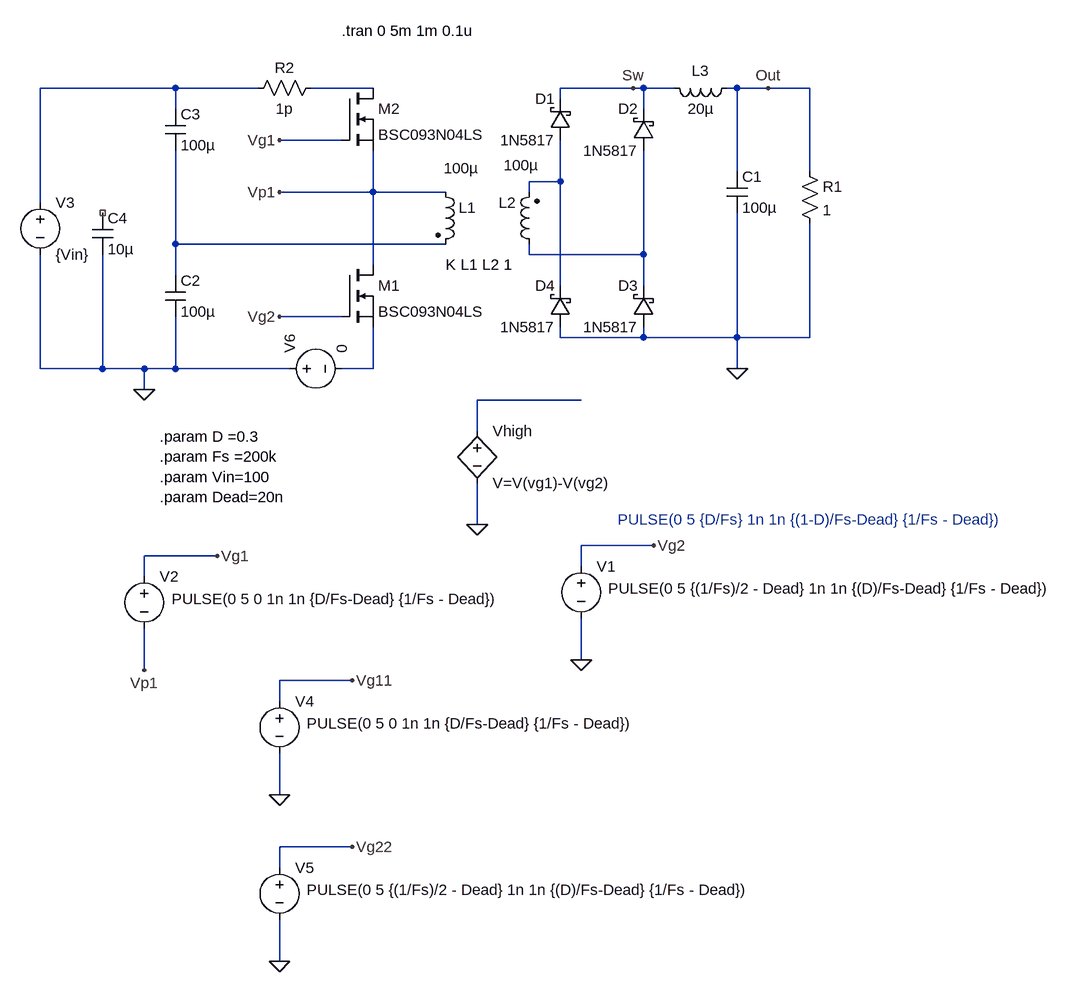
[diagram p0: schematic halflBridgeDCDC.asc]
halflBridgeDCDC.asc, the LTspice schematic file:
Version 4
SHEET 1 2100 1332
WIRE 656 -32 448 -32
WIRE 784 -32 656 -32
WIRE 960 -32 864 -32
WIRE 1360 -32 1248 -32
WIRE 1376 -32 1360 -32
WIRE 1424 -32 1376 -32
WIRE 1520 -32 1504 -32
WIRE 1568 -32 1520 -32
WIRE 1632 -32 1568 -32
WIRE 1248 -16 1248 -32
WIRE 656 0 656 -32
WIRE 1376 0 1376 -32
WIRE 912 48 816 48
WIRE 1520 96 1520 -32
WIRE 1632 96 1632 -32
WIRE 1248 112 1248 48
WIRE 1248 112 1200 112
WIRE 960 128 960 64
WIRE 960 128 816 128
WIRE 1072 128 960 128
WIRE 1200 128 1200 112
WIRE 448 144 448 -32
WIRE 656 208 656 64
WIRE 1072 208 656 208
WIRE 1200 224 1200 208
WIRE 1376 224 1376 64
WIRE 1376 224 1200 224
WIRE 960 240 960 128
WIRE 656 256 656 208
WIRE 1248 272 1248 112
WIRE 1376 272 1376 224
WIRE 912 320 816 320
WIRE 1248 352 1248 336
WIRE 1376 352 1376 336
WIRE 1376 352 1248 352
WIRE 1520 352 1520 160
WIRE 1520 352 1376 352
WIRE 1632 352 1632 176
WIRE 1632 352 1520 352
WIRE 448 400 448 224
WIRE 544 400 544 224
WIRE 544 400 448 400
WIRE 608 400 544 400
WIRE 656 400 656 320
WIRE 656 400 608 400
WIRE 832 400 656 400
WIRE 960 400 960 336
WIRE 960 400 912 400
WIRE 1520 400 1520 352
WIRE 608 432 608 400
WIRE 1280 448 1120 448
WIRE 1120 496 1120 448
WIRE 1120 640 1120 576
WIRE 1392 672 1280 672
WIRE 720 688 608 688
WIRE 1280 704 1280 672
WIRE 608 720 608 688
WIRE 1280 848 1280 784
WIRE 608 864 608 800
WIRE 928 880 816 880
WIRE 816 912 816 880
WIRE 816 1056 816 992
WIRE 928 1136 816 1136
WIRE 816 1168 816 1136
WIRE 816 1312 816 1248
FLAG 720 688 Vg1
FLAG 608 432 0
FLAG 1568 -32 Out
FLAG 1360 -32 Sw
FLAG 1520 400 0
FLAG 816 128 Vp1
FLAG 608 864 Vp1
FLAG 816 48 Vg1
FLAG 1392 672 Vg2
FLAG 1280 848 0
FLAG 816 320 Vg2
FLAG 1120 640 0
FLAG 928 880 Vg11
FLAG 816 1056 0
FLAG 928 1136 Vg22
FLAG 816 1312 0
SYMBOL voltage 608 704 R0
WINDOW 3 42 50 Left 2
WINDOW 123 0 0 Left 0
WINDOW 39 0 0 Left 0
SYMATTR Value PULSE(0 5 0 1n 1n {D/Fs-Dead} {1/Fs - Dead})
SYMATTR InstName V2
SYMBOL nmos 912 -32 R0
SYMATTR InstName M2
SYMATTR Value BSC093N04LS
SYMBOL ind2 1056 112 R0
WINDOW 3 13 -21 Left 2
SYMATTR Value 100µ
SYMATTR InstName L1
SYMATTR Type ind
SYMBOL ind2 1216 224 R180
WINDOW 0 36 80 Left 2
WINDOW 3 1 137 Left 2
SYMATTR InstName L2
SYMATTR Value 100µ
SYMATTR Type ind
SYMBOL schottky 1264 48 R180
WINDOW 0 24 64 Left 2
WINDOW 3 24 0 Left 2
SYMATTR InstName D1
SYMATTR Value 1N5817
SYMATTR Description Diode
SYMATTR Type diode
SYMBOL cap 1504 96 R0
SYMATTR InstName C1
SYMATTR Value 100µ
SYMATTR SpiceLine Rser=1m
SYMBOL ind 1520 -48 R90
WINDOW 0 5 56 VBottom 2
WINDOW 3 32 56 VTop 2
SYMATTR InstName L3
SYMATTR Value 20µ
SYMATTR SpiceLine Rser=10u
SYMBOL res 1616 80 R0
SYMATTR InstName R1
SYMATTR Value 1
SYMBOL voltage 448 128 R0
WINDOW 123 0 0 Left 0
WINDOW 39 0 0 Left 0
SYMATTR InstName V3
SYMATTR Value {Vin}
SYMBOL schottky 1392 64 R180
WINDOW 0 24 64 Left 2
WINDOW 3 24 0 Left 2
SYMATTR InstName D2
SYMATTR Value 1N5817
SYMATTR Description Diode
SYMATTR Type diode
SYMBOL schottky 1392 336 R180
WINDOW 0 24 64 Left 2
WINDOW 3 24 0 Left 2
SYMATTR InstName D3
SYMATTR Value 1N5817
SYMATTR Description Diode
SYMATTR Type diode
SYMBOL schottky 1264 336 R180
WINDOW 0 24 64 Left 2
WINDOW 3 24 0 Left 2
SYMATTR InstName D4
SYMATTR Value 1N5817
SYMATTR Description Diode
SYMATTR Type diode
SYMBOL cap 640 256 R0
SYMATTR InstName C2
SYMATTR Value 100µ
SYMBOL cap 640 0 R0
SYMATTR InstName C3
SYMATTR Value 100µ
SYMBOL cap 528 160 R0
SYMATTR InstName C4
SYMATTR Value 10µ
SYMBOL voltage 1280 688 R0
WINDOW 3 42 50 Left 2
WINDOW 123 0 0 Left 0
WINDOW 39 0 0 Left 0
SYMATTR Value PULSE(0 5 {(1/Fs)/2 - Dead} 1n 1n {(D)/Fs-Dead} {1/Fs - Dead})
SYMATTR InstName V1
SYMBOL bv 1120 480 R0
SYMATTR InstName Vhigh
SYMATTR Value V=V(vg1)-V(vg2)
SYMBOL nmos 912 240 R0
SYMATTR InstName M1
SYMATTR Value BSC093N04LS
SYMBOL voltage 816 896 R0
WINDOW 3 42 50 Left 2
WINDOW 123 0 0 Left 0
WINDOW 39 0 0 Left 0
SYMATTR Value PULSE(0 5 0 1n 1n {D/Fs-Dead} {1/Fs - Dead})
SYMATTR InstName V4
SYMBOL voltage 816 1152 R0
WINDOW 3 42 50 Left 2
WINDOW 123 0 0 Left 0
WINDOW 39 0 0 Left 0
SYMATTR Value PULSE(0 5 {(1/Fs)/2 - Dead} 1n 1n {(D)/Fs-Dead} {1/Fs - Dead})
SYMATTR InstName V5
SYMBOL res 880 -48 R90
WINDOW 0 0 56 VBottom 2
WINDOW 3 32 56 VTop 2
SYMATTR InstName R2
SYMATTR Value 1p
SYMBOL voltage 816 400 R270
WINDOW 123 0 0 Left 0
WINDOW 39 0 0 Left 0
SYMATTR InstName V6
SYMATTR Value 0
TEXT 912 -120 Left 2 !.tran 0 5m 1m 0.1u
TEXT 1072 240 Left 2 !K L1 L2 1
TEXT 632 504 Left 2 !.param D =0.3\n.param Fs =200k\n.param Vin=100\n.param Dead=20n
TEXT 1336 632 Left 2 ;PULSE(0 5 {D/Fs} 1n 1n {(1-D)/Fs-Dead} {1/Fs - Dead})

The netlist it stands for:
* halflBridgeDCDC.asc
V2 Vg1 Vp1 PULSE(0 5 0 1n 1n {D/Fs-Dead} {1/Fs - Dead})
M2 N002 Vg1 Vp1 Vp1 BSC093N04LS
L1 Vp1 N004 100µ
L2 N005 N003 100µ
D1 N003 Sw 1N5817
C1 Out 0 100µ Rser=1m
L3 Out Sw 20µ Rser=10u
R1 Out 0 1
V3 N001 0 {Vin}
D2 N005 Sw 1N5817
D3 0 N005 1N5817
D4 0 N003 1N5817
C2 N004 0 100µ
C3 N001 N004 100µ
C4 NC_01 0 10µ
V1 Vg2 0 PULSE(0 5 {(1/Fs)/2 - Dead} 1n 1n {(D)/Fs-Dead} {1/Fs - Dead})
B§Vhigh N007 0 V=V(vg1)-V(vg2)
M1 Vp1 Vg2 N006 N006 BSC093N04LS
V4 Vg11 0 PULSE(0 5 0 1n 1n {D/Fs-Dead} {1/Fs - Dead})
V5 Vg22 0 PULSE(0 5 {(1/Fs)/2 - Dead} 1n 1n {(D)/Fs-Dead} {1/Fs - Dead})
R2 N002 N001 1p
V6 0 N006 0
.model D D
.lib standard.dio
.model NMOS NMOS
.model PMOS PMOS
.lib standard.mos
.tran 0 5m 1m 0.1u
K L1 L2 1
.param D =0.3
.param Fs =200k
.param Vin=100
.param Dead=20n
* PULSE(0 5 {D/Fs} 1n 1n {(1-D)/Fs-Dead} {1/Fs - Dead})
.backanno
.end